# Altium schematic sheet power.SchDoc
size A4
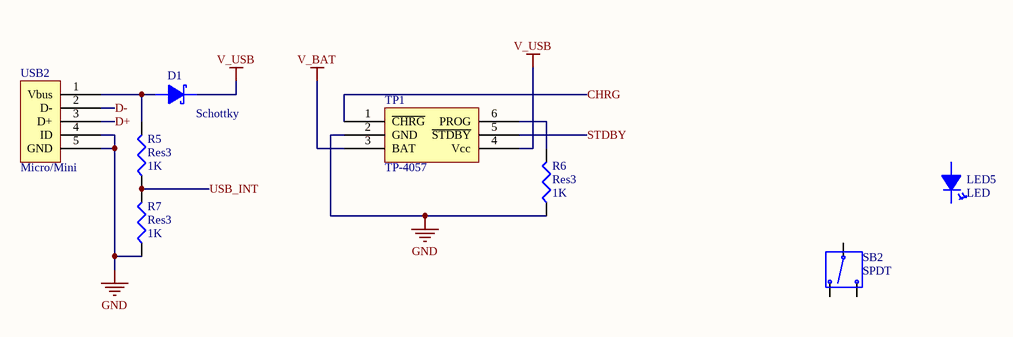
[diagram p0: power.SchDoc]

## Parts
D1  Schottky  [SOD-523]
LED5  LED  [LED_3mm_DIP]
R5  Res3  value 1K  [J1-0603]
R6  Res3  value 1K  [J1-0603]
R7  Res3  value 1K  [J1-0603]
SB2  SPDT  [SS-SK-02P]
TP1  TP-4057  [SOT-23-6]
USB2  Micro/Mini  [USB_Micro-B_S_DIP_180]

## Nets
GND: R6.1 R7.1 TP1.2(GND) USB2.4(ID) USB2.5(GND)
V_BAT: TP1.3(BAT)
V_USB: D1.2 TP1.4(Vcc)
CHRG: TP1.1(~{CHRG})
D+: USB2.3(D+)
D-: USB2.2(D-)
STDBY: TP1.5(~{STDBY})
USB_INT: R5.1 R7.2
NetD1_1: D1.1 R5.2 USB2.1(Vbus)
NetR6_2: R6.2 TP1.6(PROG)

Not connected (* = marked no-connect by the designer): LED5 1 2; SB2 1 2 3

## Library data of the parts
D1 = Diode2
R5-R7 = Res3: Resistor; Published: 8-Jun-2000; LatestRevisionDate: 29-May-2009; LatestRevisionNote: IPC-7351 Footprint Added.; PackageReference: J1-0603; Publisher: Altium Limited; PackageDescription: Chip Resistor
SB2 = Switch_Button2
USB2 = USB2